# EAGLE design 1 (EAGLE 5.11)
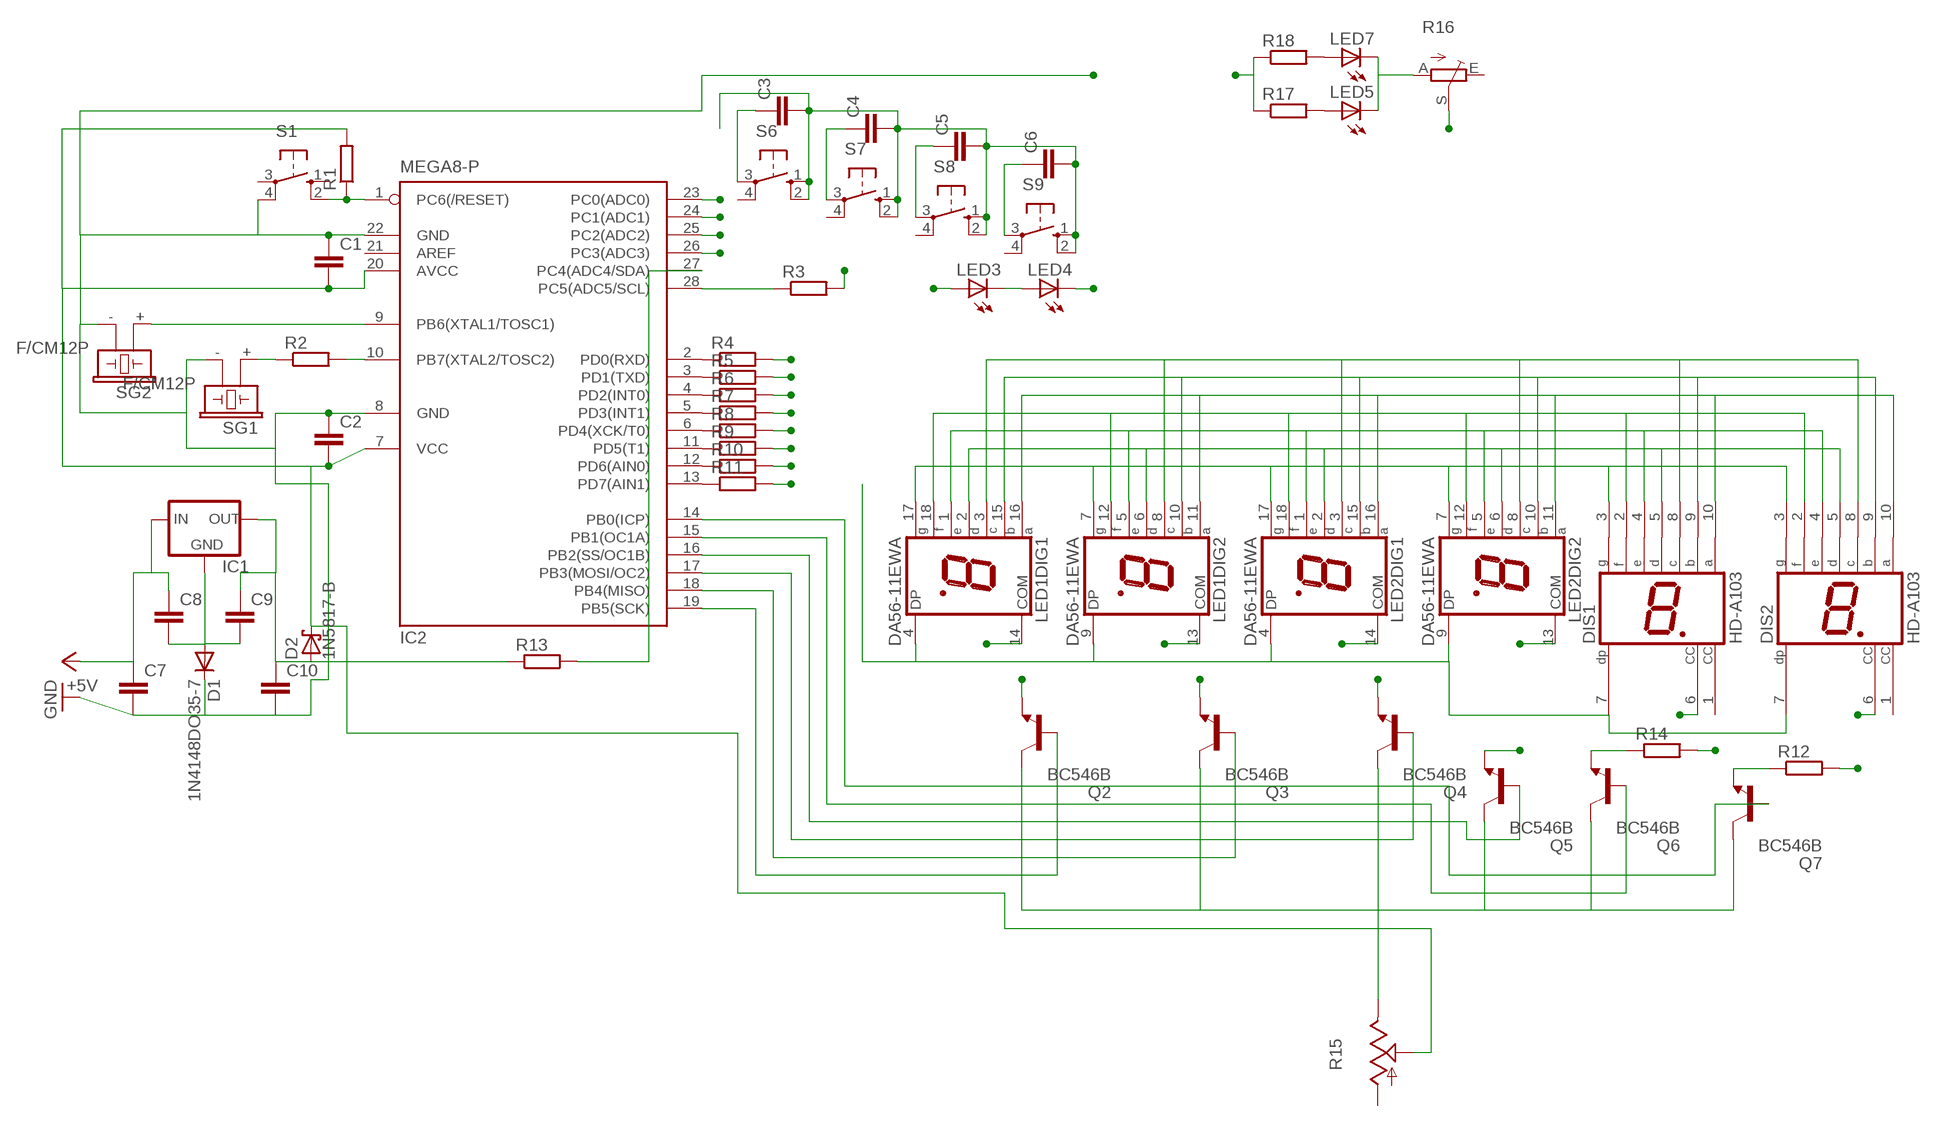
[diagram p0: schematic, sheet 1]

## Parts
C1  C5/3  [C5B3]
C2  C5/3  [C5B3]
C3  C5/3  [C5B3]
C4  C5/3  [C5B3]
C5  C5/3  [C5B3]
C6  C5/3  [C5B3]
C7  C5/7.2  [C5B7.2]
C8  C5/3  [C5B3]
C9  C5/3  [C5B3]
C10  C2.5/6  [C2.5-6]
D1  1N4148DO35-7  [DO35-7]
D2  1N5817-B  [DO41-7.6]
DIS1  HD-A103  [HDSP-A]
DIS2  HD-A103  [HDSP-A]
IC1  78XXL  [78XXL]
IC2  MEGA8-P  [DIL28-3]
LED1  DA56-11EWA  [DA56]
LED2  DA56-11EWA  [DA56]
LED3  LED5MM  [LED5MM]
LED4  LED5MM  [LED5MM]
LED5  LED5MM  [LED5MM]
LED7  LED5MM  [LED5MM]
Q2  BC546B  [TO92-EBC]
Q3  BC546B  [TO92-EBC]
Q4  BC546B  [TO92-EBC]
Q5  BC546B  [TO92-EBC]
Q6  BC546B  [TO92-EBC]
Q7  BC546B  [TO92-EBC]
R1  R-EU_0204/7  [0204/7]
R2  R-EU_0204/7  [0204/7]
R3  R-EU_0204/7  [0204/7]
R4  R-EU_0204/7  [0204/7]
R5  R-EU_0204/7  [0204/7]
R6  R-EU_0204/7  [0204/7]
R7  R-EU_0204/7  [0204/7]
R8  R-EU_0204/7  [0204/7]
R9  R-EU_0204/7  [0204/7]
R10  R-EU_0204/7  [0204/7]
R11  R-EU_0204/7  [0204/7]
R12  R-EU_0204/7  [0204/7]
R13  R-EU_0204/7  [0204/7]
R14  R-EU_0204/7  [0204/7]
R15  TRIM_US-RJ9W  [RJ9W]
R16  TRIM_EU-CA6V  [CA6V]
R17  R-EU_0204/7  [0204/7]
R18  R-EU_0204/7  [0204/7]
S1  10-XX  [B3F-10XX]
S6  10-XX  [B3F-10XX]
S7  10-XX  [B3F-10XX]
S8  10-XX  [B3F-10XX]
S9  10-XX  [B3F-10XX]
SG1  F/CM12P  [F/CM12P]
SG2  F/CM12P  [F/CM12P]

## Nets
+5V: C7.1 C8.1 IC1.IN
GND: C1.1 C2.1 C7.2 C10.2 D1.C IC2.8(GND) S1.4(P1) SG1.- SG2.-
N$1: IC2.1(PC6(/RESET)) R1.1 S1.2(S1)
N$2: IC2.9(PB6(XTAL1/TOSC1)) SG2.+
N$3: IC2.10(PB7(XTAL2/TOSC2)) R2.2
N$4: R2.1 SG1.+
N$5: C3.2 C4.2 C5.2 C6.2 S6.1(S) S6.2(S1) S7.1(S) S7.2(S1) S8.1(S) S8.2(S1) S9.1(S) S9.2(S1)
N$6: LED5.K(C) LED7.K(C) R16.A
N$7: LED5.A R17.2
N$8: LED7.A R18.2
N$9: C1.2 C2.2 D2.C IC2.7(VCC) IC2.20(AVCC) R1.2 R15.S
N$10: C3.1 S6.3(P)
N$11: C8.2 C9.2 D1.A IC1.GND
N$12: IC2.2(PD0(RXD)) R4.1
N$13: IC2.3(PD1(TXD)) R5.1
N$14: C4.1 S7.3(P)
N$15: C5.1 S8.3(P)
N$16: C6.1 S9.3(P)
N$17: DIS1.8(C) DIS2.8(C) LED1.3(DIG1:C) LED1.8(DIG2:C) LED2.3(DIG1:C) LED2.8(DIG2:C)
N$18: DIS1.9(B) DIS2.9(B) LED1.10(DIG2:B) LED1.15(DIG1:B) LED2.10(DIG2:B) LED2.15(DIG1:B)
N$19: DIS1.10(A) DIS2.10(A) LED1.11(DIG2:A) LED1.16(DIG1:A) LED2.11(DIG2:A) LED2.16(DIG1:A)
N$20: DIS1.2(F) DIS2.2(F) LED1.12(DIG2:F) LED1.18(DIG1:F) LED2.12(DIG2:F) LED2.18(DIG1:F)
N$21: DIS1.4(E) DIS2.4(E) LED1.1(DIG1:E) LED1.5(DIG2:E) LED2.1(DIG1:E) LED2.5(DIG2:E)
N$22: DIS1.5(D) DIS2.5(D) LED1.2(DIG1:D) LED1.6(DIG2:D) LED2.2(DIG1:D) LED2.6(DIG2:D)
N$23: DIS1.3(G) DIS2.3(G) LED1.7(DIG2:G) LED1.17(DIG1:G) LED2.7(DIG2:G) LED2.17(DIG1:G)
N$24: DIS1.7(DP) DIS2.7(DP) LED1.4(DIG1:DP) LED1.9(DIG2:DP) LED2.4(DIG1:DP) LED2.9(DIG2:DP)
N$25: R17.1 R18.1
N$26: C9.1 C10.1 D2.A IC1.OUT R13.1
N$27: LED4.K(C)
N$28: IC2.14(PB0(ICP)) Q7.B
N$29: IC2.4(PD2(INT0)) R6.1
N$30: IC2.28(PC5(ADC5/SCL)) R3.1
N$31: LED3.K(C) LED4.A
N$32: R4.2
N$33: IC2.15(PB1(OC1A)) Q6.B
N$34: IC2.16(PB2(SS/OC1B)) Q5.B
N$35: IC2.17(PB3(MOSI/OC2)) Q4.B
N$36: IC2.18(PB4(MISO)) Q3.B
N$37: IC2.19(PB5(SCK)) Q2.B
N$38: R5.2
N$39: R6.2
N$40: R7.2
N$41: Q5.E
N$42: Q6.E R14.1
N$43: Q7.E R12.1
N$44: Q2.C Q3.C Q4.C Q5.C Q6.C Q7.C R15.E
N$45: IC2.27(PC4(ADC4/SDA)) R13.2
N$46: IC2.5(PD3(INT1)) R7.1
N$47: IC2.6(PD4(XCK/T0)) R8.1
N$48: IC2.11(PD5(T1)) R9.1
N$49: IC2.12(PD6(AIN0)) R10.1
N$50: IC2.13(PD7(AIN1)) R11.1
N$51: R8.2
N$52: R9.2
N$53: R10.2
N$54: R11.2
N$55: IC2.23(PC0(ADC0))
N$56: IC2.24(PC1(ADC1))
N$57: IC2.25(PC2(ADC2))
N$58: IC2.26(PC3(ADC3))
N$59: Q2.E
N$60: Q3.E
N$61: Q4.E
N$62: R14.2
N$63: R12.2
N$64: R3.2
N$65: LED3.A
N$66: R16.S
N$67: LED1.14(DIG1:COM)
N$68: LED1.13(DIG2:COM)
N$69: LED2.14(DIG1:COM)
N$70: LED2.13(DIG2:COM)
N$71: DIS1.6(CC)
N$72: DIS2.6(CC)
Unconnected: DIS1.1(CC) DIS2.1(CC) IC2.21(AREF) R15.A R16.E S1.1(S) S1.3(P) S6.4(P1) S7.4(P1) S8.4(P1) S9.4(P1)

## Power pins joined to a net without a drawn wire
GND: IC2.22(GND)

## Library data of the parts
C1-C10 = capacitor-wima:C: CAPACITOR naming: grid - package width
D1 = diode:1N4148: DIODE high speed (Philips)
D2 = diode:1N581*: 1.0A SCHOTTKY BARRIER RECTIFIER Source: http://www.diodes.com/datasheets/ds23001.pdf
DIS1 DIS2 = display-hp:HD-A103: LED DISPLAY 1-character 7 segment, decimal point right; OC_FARNELL: unknown; OC_NEWARK: unknown
IC1 = v-reg:78XXL: VOLTAGE REGULATOR
IC2 = atmel:MEGA8-P: MICROCONTROLLER 8 Kbytes FLASH, 1 kbytes SRAM, 512 bytes EEPROM, USART, 4-channel 10 bit ADC, 2-channel 8 bit ADC Pin compatible with Atmega48, ATMega88, ATMega168 Source: avr.lbr; OC_FARNELL: unknown; OC_NEWARK: unknown
LED1 LED2 = display-kingbright:DA56-11: 14.22mm (0.56INCH) DUAL DIGIT NUMERIC DISPLAYS Source: www.kingbright.com .. DA56-11SRWA.pdf; OC_FARNELL: unknown; OC_NEWARK: unknown
LED3-LED5 LED7 = led:LED: LED OSRAM: - CHIPLED LG R971, LG N971, LY N971, LG Q971, LY Q971, LO R971, LY R971 LH N974, LH R974 LS Q976, LO Q976, LY Q976 LO Q996 - Hyper CHIPLED LW Q18S LB Q993, LB Q99A, LB R99A - SideLED LS A670, LO A670, LY A670, LG A670, LP A670 LB A673, LV A673, LT A673, LW A673 LH A674 LY A675 LS A676, LA A676, LO A676, LY A676, LW A676 LS A679, LY A679, LG A679 - Hyper Micro SIDELED® LS Y876, LA Y876, LO Y876, LY Y876 LT Y87S - SmartLED LW L88C, LW L88S LB L89C, LB L89S, LG L890 LS L89K, LO L89K, LY L89K LS L896, LA L896, LO L896, LY L896 - TOPLED LS T670, LO T670, LY T670, LG T670, LP T670 LSG T670, LSP T670, LSY T670, LOP T670, LYG T670 LG T671, LOG T671, LSG T671 LB T673, LV T673, LT T673, LW T673 LH T674 LS T676, LA T676, LO T676, LY T676, LB T676, LH T676, LSB T676, LW T676 LB T67C, LV T67C, LT T67C, LS T67K, LO T67K, LY T67K, LW E67C LS E67B, LA E67B, LO E67B, LY E67B, LB E67C, LV E67C, LT E67C LW T67C LS T679, LY T679, LG T679 LS T770, LO T770, LY T770, LG T770, LP T770 LB T773, LV T773, LT T773, LW T773 LH T774 LS E675, LA E675, LY E675, LS T675 LS T776, LA T776, LO T776, LY T776, LB T776 LHGB T686 LT T68C, LB T68C - Hyper Mini TOPLED® LB M676 - Mini TOPLED Santana® LG M470 LS M47K, LO M47K, LY M47K Source: http://www.osram.convergy.de LUXEON: - LUMILED® LXK2-PW12-R00, LXK2-PW12-S00, LXK2-PW14-U00, LXK2-PW14-V00 LXK2-PM12-R00, LXK2-PM12-S00, LXK2-PM14-U00 LXK2-PE12-Q00, LXK2-PE12-R00, LXK2-PE12-S00, LXK2-PE14-T00, LXK2-PE14-U00 LXK2-PB12-K00, LXK2-PB12-L00, LXK2-PB12-M00, LXK2-PB14-N00, LXK2-PB14-P00, LXK2-PB14-Q00 LXK2-PR12-L00, LXK2-PR12-M00, LXK2-PR14-Q00, LXK2-PR14-R00 LXK2-PD12-Q00, LXK2-PD12-R00, LXK2-PD12-S00 LXK2-PH12-R00, LXK2-PH12-S00 LXK2-PL12-P00, LXK2-PL12-Q00, LXK2-PL12-R00 Source: www.luxeon.com KINGBRIGHT: KA-3528ASYC Source: www.kingbright.com
Q2-Q7 = transistor-npn:BC546*: NPN Transistor
R1-R14 R17 R18 = rcl:R-EU_: RESISTOR, European symbol
R15 = pot:TRIM_US-: POTENTIOMETER
R16 = pot:TRIM_EU-: POTENTIOMETER
S1 S6-S9 = switch-omron:10-XX: OMRON SWITCH; MPN: B3F-1000; OC_FARNELL: 176432; OC_NEWARK: 36M3542
SG1 SG2 = buzzer:F/CM12P: BUZZER Source: Buerklin; OC_FARNELL: unknown; OC_NEWARK: unknown

## Board
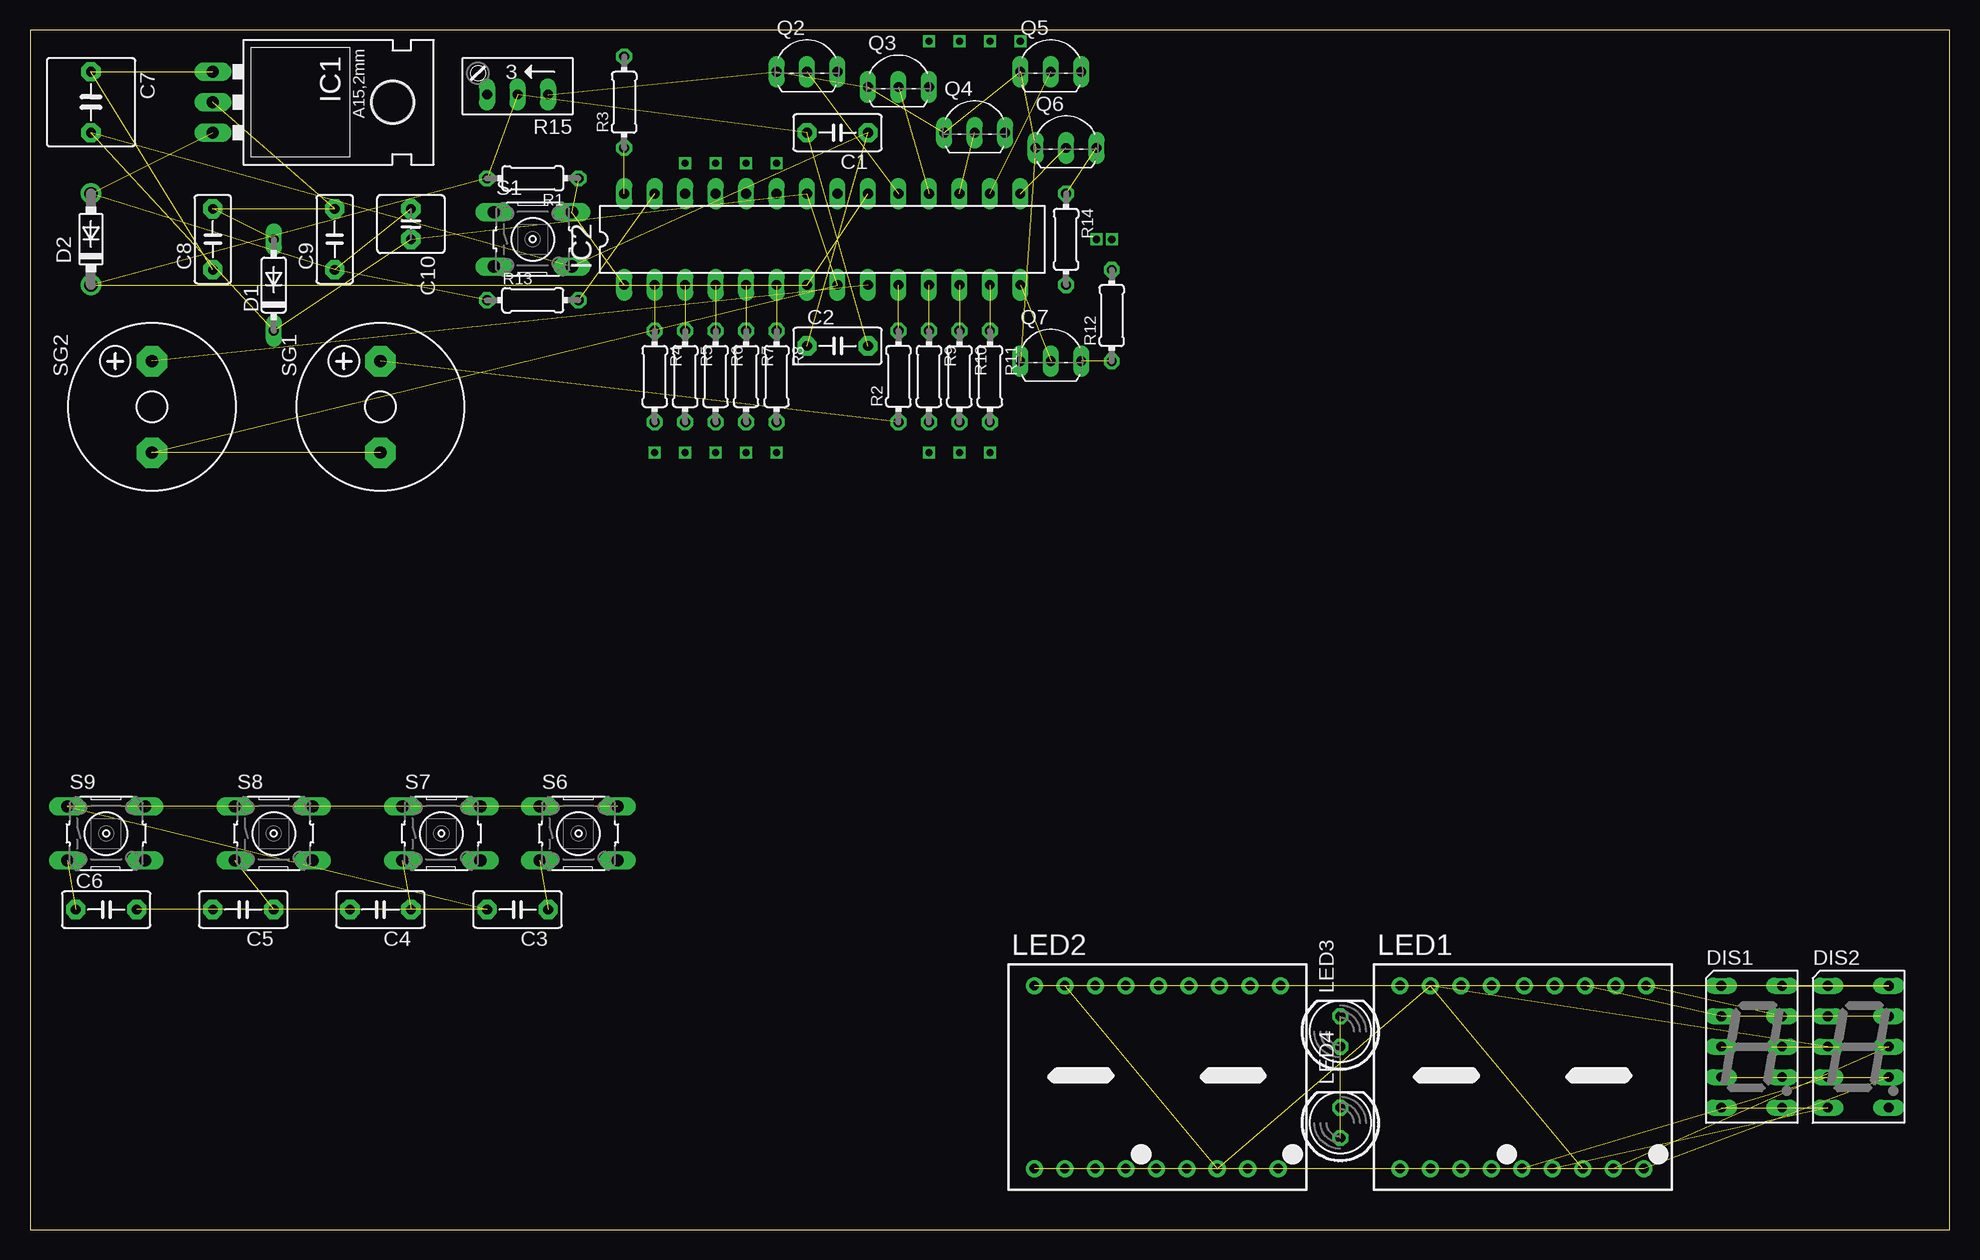
[diagram p1: board, top side]
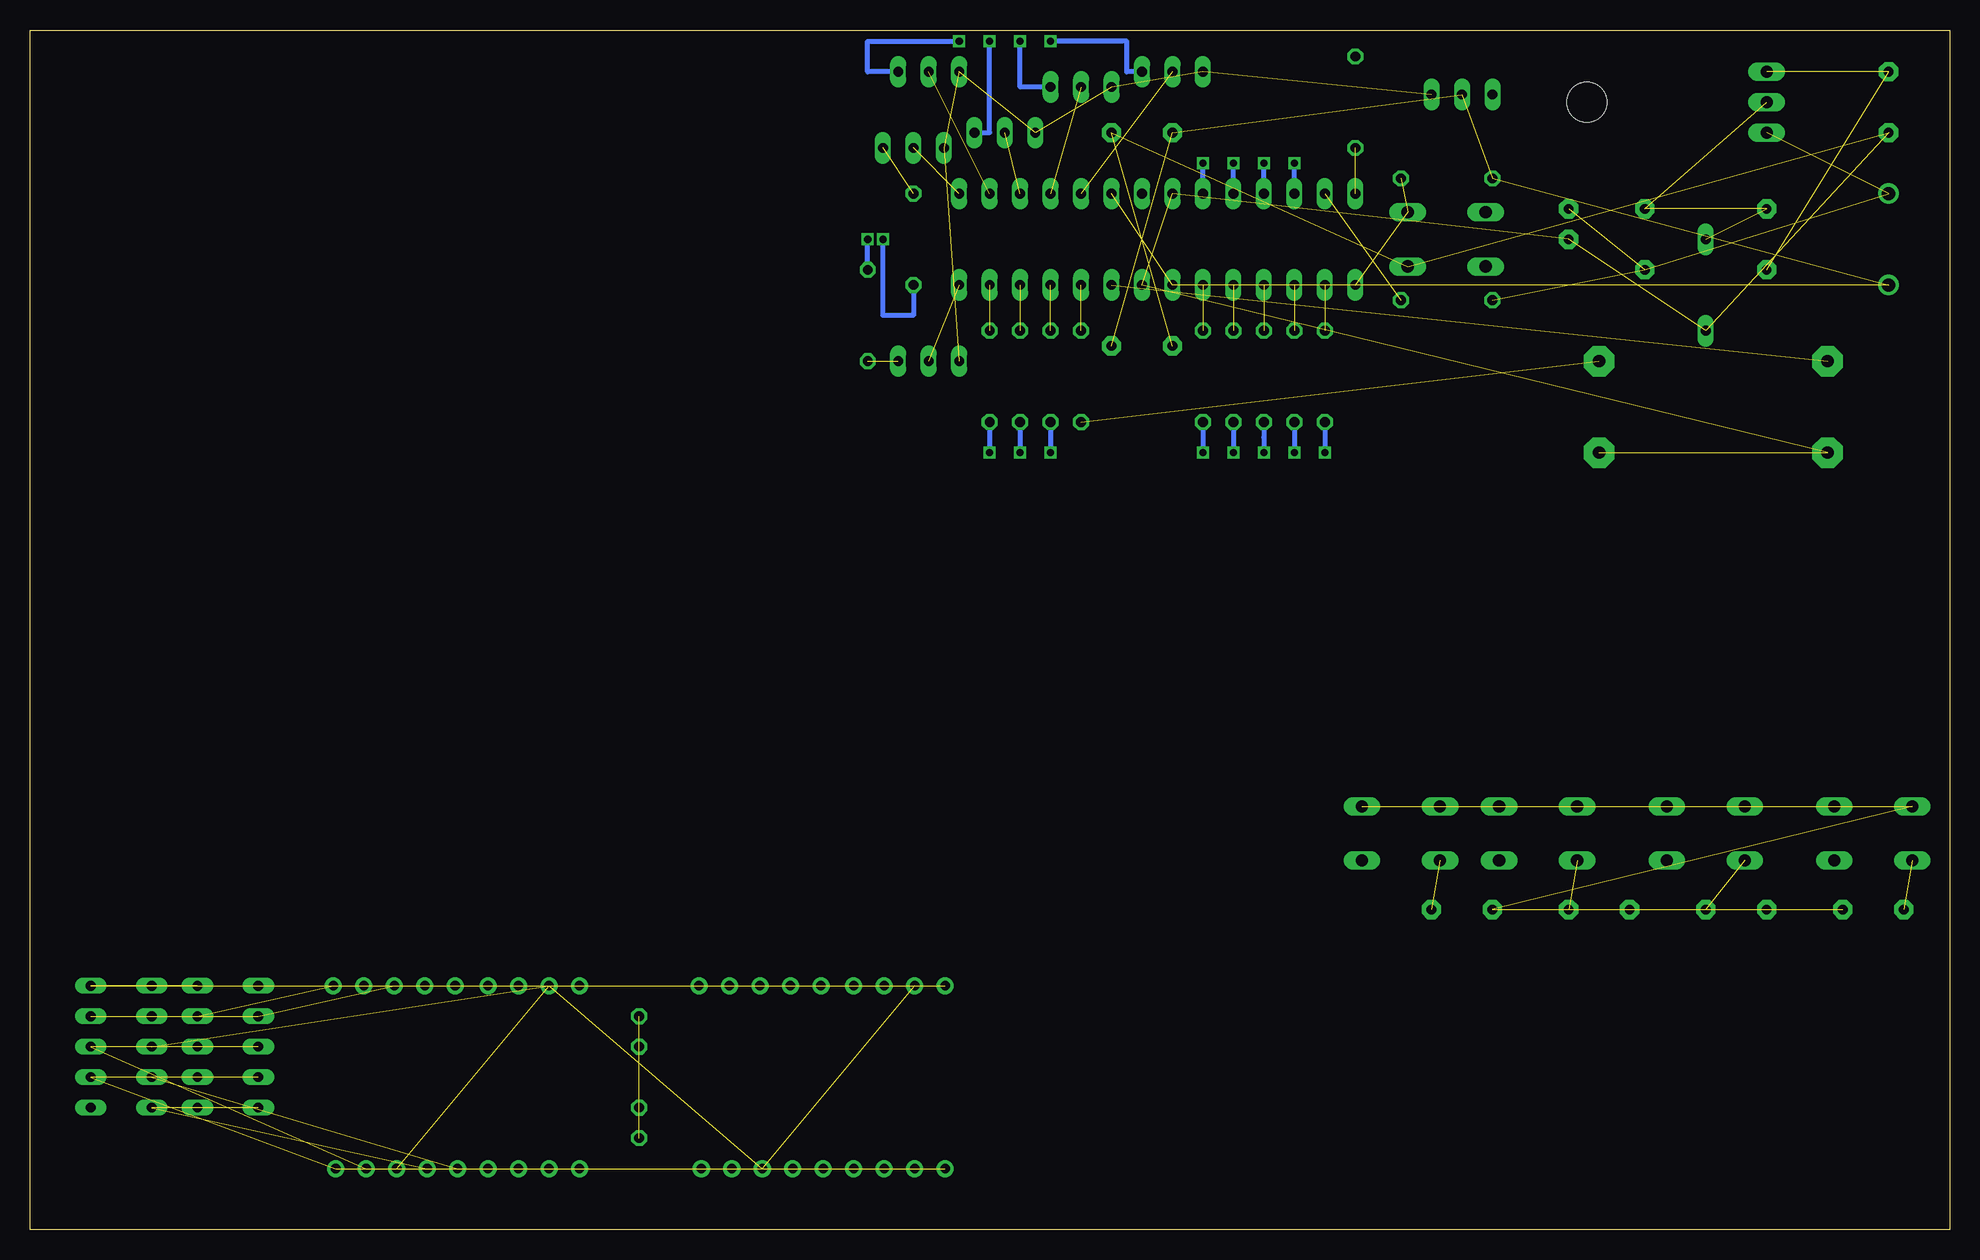
[diagram p2: board, bottom side, seen from below]

Size 160 x 100 mm. Coordinates in mm from the lower left corner, seen from the top.
Outline: 0,0 160,0 160,100 0,100 0,0
Copper layers (1*16): Top 0.035mm / dielectric 1.5mm / Bottom 0.035mm
Design rules "default": minimum track width 10mil, minimum drill 24mil, track to track 8mil, track to pad 8mil, pad to pad 8mil, via to via 8mil, smd to smd 8mil, copper to edge 40mil, drill to drill 8mil, minimum pad ring 10mil, minimum via ring 8mil, stop-mask expansion 4mil, vias tented up to drill 0mil, thermal gap 10mil

### Footprints (pad centres in the part's own frame; a part is rotated, then mirrored left to right if it is on the bottom)
C5B3 = drill 0.813 pad 1.6 octagon: 1 -2.54,0; 2 2.54,0
C5B7.2 = drill 0.813 pad 1.6 octagon: 1 -2.54,0; 2 2.54,0
C2.5-6 = drill 0.813 pad 1.6 octagon: 1 -1.27,0; 2 1.27,0
DO35-7 = drill 0.813 long: A 3.81,0; C -3.81,0
DO41-7.6 = drill 1.1 pad 1.7 round: A 3.81,0; C -3.81,0
HDSP-A = drill 0.813 long: 1 -2.54,5.08; 2 -2.54,2.54; 3 -2.54,0; 4 -2.54,-2.54; 5 -2.54,-5.08; 6 2.54,-5.08; 7 2.54,-2.54; 8 2.54,0; 9 2.54,2.54; 10 2.54,5.08
78XXL = drill 1.016 long: GND 0,-3.81; IN -2.54,-3.81; OUT 2.54,-3.81 | hole 3.302: 0,11.176
DIL28-3 = drill 0.813 long: 1 -16.51,-3.81; 2 -13.97,-3.81; 3 -11.43,-3.81; 4 -8.89,-3.81; 5 -6.35,-3.81; 6 -3.81,-3.81; 7 -1.27,-3.81; 8 1.27,-3.81; 9 3.81,-3.81; 10 6.35,-3.81; 11 8.89,-3.81; 12 11.43,-3.81; 13 13.97,-3.81; 14 16.51,-3.81; 15 16.51,3.81; 16 13.97,3.81; 17 11.43,3.81; 18 8.89,3.81; 19 6.35,3.81; 20 3.81,3.81; 21 1.27,3.81; 22 -1.27,3.81; 23 -3.81,3.81; 24 -6.35,3.81; 25 -8.89,3.81; 26 -11.43,3.81; 27 -13.97,3.81; 28 -16.51,3.81
DA56 = drill 0.8 pad 1.422 round: 1 -10.26,-7.62; 2 -7.72,-7.62; 3 -5.18,-7.62; 4 -2.64,-7.62; 5 -0.1,-7.62; 6 2.44,-7.62; 7 4.98,-7.62; 8 7.52,-7.62; 9 10.06,-7.62; 10 10.26,7.62; 11 7.72,7.62; 12 5.18,7.62; 13 2.64,7.62; 14 0.1,7.62; 15 -2.64,7.62; 16 -5.18,7.62; 17 -7.72,7.62; 18 -10.26,7.62
LED5MM = drill 0.813 octagon: A -1.27,0; K 1.27,0
TO92-EBC = drill 0.813 long: B 0,-1.27; C -2.54,-1.27; E 2.54,-1.27
0204/7 = drill 0.813 octagon: 1 -3.81,0; 2 3.81,0
RJ9W = drill 0.813 long: A 2.54,0.635; E -2.54,0.635; S 0,0.635
CA6V = drill 1.016 long: A -2.54,-2.54; E 2.54,-2.54; S 0,2.54
B3F-10XX = drill 1.016 long: 1 -3.251,2.261; 2 3.251,2.261; 3 -3.251,-2.261; 4 3.251,-2.261
F/CM12P = drill 1.016 pad 2.54 octagon: + 3.81,0; - -3.81,0

### Placement (x,y rotation side)
C1  67.31,91.44 180 top
C2  67.31,73.66 0 top
C3  40.64,26.67 180 top
C4  29.21,26.67 180 top
C5  17.78,26.67 180 top
C6  6.35,26.67 0 top
C7  5.08,93.98 270 top
C8  15.24,82.55 90 top
C9  25.4,82.55 90 top
C10  31.75,83.82 270 top
D1  20.32,78.74 90 top
D2  5.08,82.55 90 top
DIS1  143.51,15.24 0 top
DIS2  152.4,15.24 0 top
IC1  19.05,93.98 270 top
IC2  66.04,82.55 0 top
LED1  124.46,12.7 0 top
LED2  93.98,12.7 0 top
LED3  109.22,16.51 90 top
LED4  109.22,8.89 90 top
LED5  -135.89,58.42 0 top  (outside the outline)
LED7  -135.89,77.47 0 top  (outside the outline)
Q2  64.77,97.79 0 top
Q3  72.39,96.52 0 top
Q4  78.74,92.71 0 top
Q5  85.09,97.79 0 top
Q6  86.36,91.44 0 top
Q7  85.09,73.66 0 top
R1  41.91,87.63 180 top
R2  72.39,71.12 90 top
R3  49.53,93.98 90 top
R4  52.07,71.12 270 top
R5  54.61,71.12 270 top
R6  57.15,71.12 270 top
R7  59.69,71.12 270 top
R8  62.23,71.12 270 top
R9  74.93,71.12 270 top
R10  77.47,71.12 270 top
R11  80.01,71.12 270 top
R12  90.17,76.2 90 top
R13  41.91,77.47 0 top
R14  86.36,82.55 270 top
R15  40.64,95.25 180 top
R16  -132.08,39.37 270 top  (outside the outline)
R17  -106.68,58.42 180 top  (outside the outline)
R18  -106.68,77.47 180 top  (outside the outline)
S1  41.91,82.55 0 top
S6  45.72,33.02 0 top
S7  34.29,33.02 0 top
S8  20.32,33.02 0 top
S9  6.35,33.02 0 top
SG1  29.21,68.58 90 top
SG2  10.16,68.58 90 top

### Tracks (layer width: path | path; a pad name or v marks a point on that pad's centre or on a via)
+5V  (2 unrouted)
GND  (9 unrouted)
N$1  (2 unrouted)
N$2  (1 unrouted)
N$3  (1 unrouted)
N$4  (1 unrouted)
N$5  (11 unrouted)
N$6  (2 unrouted)
N$7  (1 unrouted)
N$8  (1 unrouted)
N$9  (6 unrouted)
N$10  (1 unrouted)
N$11  (3 unrouted)
N$12  (1 unrouted)
N$13  (1 unrouted)
N$14  (1 unrouted)
N$15  (1 unrouted)
N$16  (1 unrouted)
N$17  (5 unrouted)
N$18  (5 unrouted)
N$19  (5 unrouted)
N$20  (5 unrouted)
N$21  (5 unrouted)
N$22  (5 unrouted)
N$23  (5 unrouted)
N$24  (5 unrouted)
N$25  (1 unrouted)
N$26  (4 unrouted)
N$28  (1 unrouted)
N$29  (1 unrouted)
N$30  (1 unrouted)
N$31  (1 unrouted)
N$32  (via drill 0.6)
  Bottom 0.406: R4.2 v52.07,64.77
N$33  (1 unrouted)
N$34  (1 unrouted)
N$35  (1 unrouted)
N$36  (1 unrouted)
N$37  (1 unrouted)
N$38  (via drill 0.6)
  Bottom 0.406: R5.2 v54.61,64.77
N$39  (via drill 0.6)
  Bottom 0.406: 57.15,66.04 R6.2 v57.15,64.77
N$40  (via drill 0.6)
  Bottom 0.406: R7.2 v59.69,64.77
N$41  (via drill 0.6)
  Bottom 0.406: Q5.E 90.17,96.52 90.17,99.06 v82.55,99.06
N$42  (1 unrouted)
N$43  (1 unrouted)
N$44  (6 unrouted)
N$45  (1 unrouted)
N$46  (1 unrouted)
N$47  (1 unrouted)
N$48  (1 unrouted)
N$49  (1 unrouted)
N$50  (1 unrouted)
N$51  (via drill 0.6)
  Bottom 0.406: R8.2 v62.23,64.77
N$52  (via drill 0.6)
  Bottom 0.406: R9.2 v74.93,64.77
N$53  (via drill 0.6)
  Bottom 0.406: R10.2 v77.47,64.77
N$54  (via drill 0.6)
  Bottom 0.406: R11.2 v80.01,64.77
N$55  (via drill 0.6)
  Bottom 0.406: IC2.23 v62.23,88.9
N$56  (via drill 0.6)
  Bottom 0.406: IC2.24 v59.69,88.9
N$57  (via drill 0.6)
  Bottom 0.406: IC2.25 v57.15,88.9
N$58  (via drill 0.6)
  Bottom 0.406: IC2.26 v54.61,88.9
N$59  (via drill 0.6)
  Bottom 0.406: Q2.E 68.58,96.52 68.58,99.06 v74.93,99.06
N$60  (via drill 0.6)
  Bottom 0.406: Q3.E 77.47,95.25 v77.47,99.06
N$61  (via drill 0.6)
  Bottom 0.406: Q4.E 80.01,91.44 v80.01,99.06
N$62  (via drill 0.6)
  Bottom 0.406: R14.2 86.36,76.2 88.9,76.2 v88.9,82.55
N$63  (via drill 0.6)
  Bottom 0.406: R12.2 v90.17,82.55